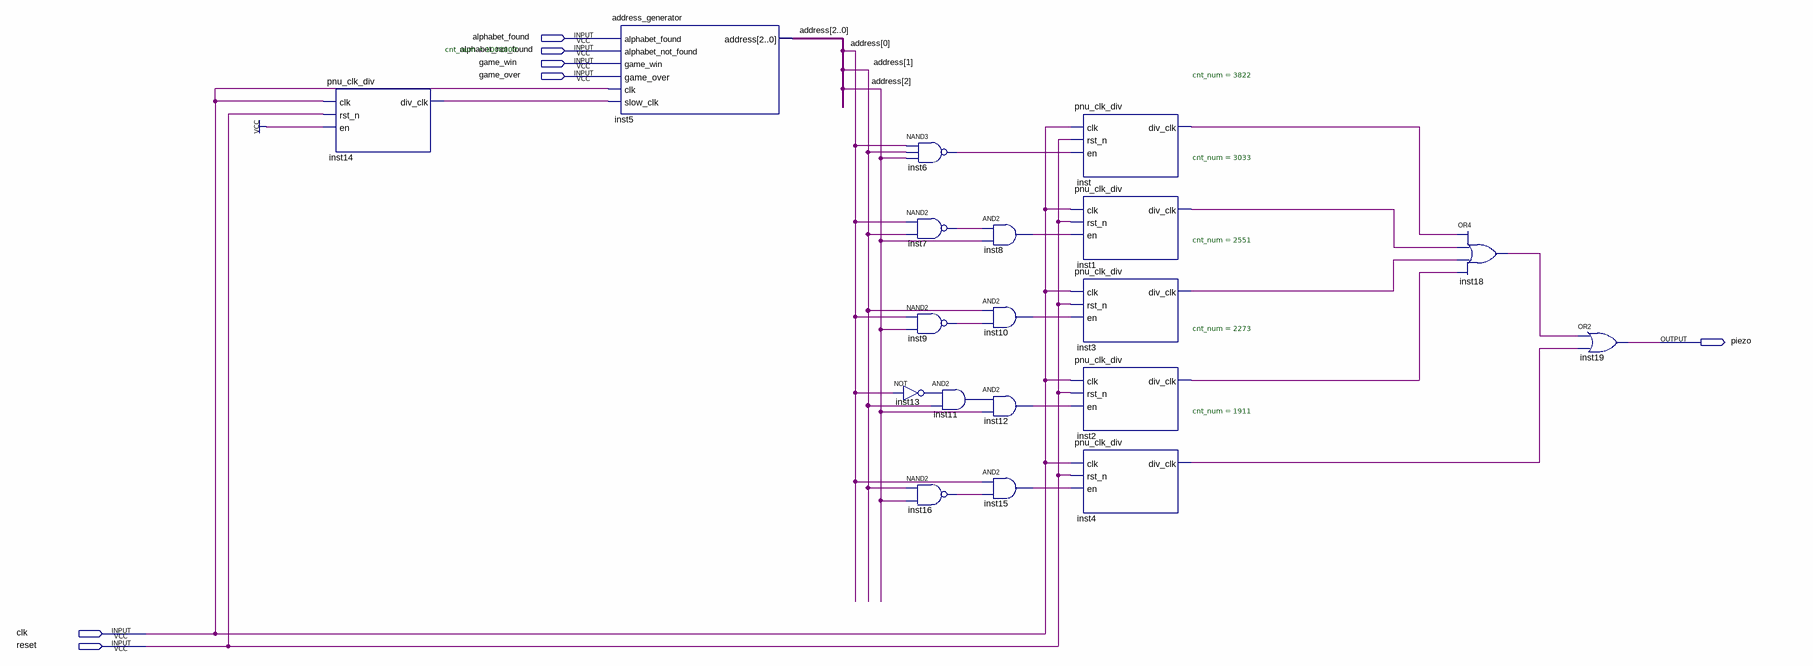
[diagram p0: schematic sheet]
// Quartus schematic sound_controller.bdf as structural Verilog: 19 symbols, 7 pins
module sound_controller (
  input  alphabet_found,
  input  alphabet_not_found,
  input  game_win,
  input  game_over,
  input  clk,
  input  reset,
  output piezo
);

  wire inst1_div_clk, inst2_div_clk, inst3_div_clk, inst4_div_clk, inst6_out, inst7_out, inst8_out,
       inst9_out, inst10_out, inst11_out, inst12_out, inst13_out, inst14_div_clk, inst15_out, inst16_out,
       inst18_out, inst_div_clk;
  wire [2:0] address;

  pnu_clk_div #(.cnt_num(1000000)) inst14 (.clk(clk), .rst_n(reset), .en(1'b1), .div_clk(inst14_div_clk));
  address_generator inst5 (
    .alphabet_found(alphabet_found), .alphabet_not_found(alphabet_not_found), .game_win(game_win),
    .game_over(game_over), .clk(clk), .slow_clk(inst14_div_clk), .address(address));
  not inst13 (inst13_out, address[0]);
  nand inst6 (inst6_out, address[0], address[1], address[2]);
  nand inst7 (inst7_out, address[0], address[1]);
  nand inst9 (inst9_out, address[0], address[2]);
  and inst11 (inst11_out, inst13_out, address[1]);
  nand inst16 (inst16_out, address[1], address[2]);
  and inst8 (inst8_out, inst7_out, address[2]);
  and inst10 (inst10_out, address[1], inst9_out);
  and inst12 (inst12_out, inst11_out, address[2]);
  and inst15 (inst15_out, address[0], inst16_out);
  pnu_clk_div #(.cnt_num(3822)) inst (.clk(clk), .rst_n(reset), .en(inst6_out), .div_clk(inst_div_clk));
  pnu_clk_div #(.cnt_num(3033)) inst1 (.clk(clk), .rst_n(reset), .en(inst8_out), .div_clk(inst1_div_clk));
  pnu_clk_div #(.cnt_num(2551)) inst3 (.clk(clk), .rst_n(reset), .en(inst10_out), .div_clk(inst3_div_clk));
  pnu_clk_div #(.cnt_num(2273)) inst2 (.clk(clk), .rst_n(reset), .en(inst12_out), .div_clk(inst2_div_clk));
  pnu_clk_div #(.cnt_num(1911)) inst4 (.clk(clk), .rst_n(reset), .en(inst15_out), .div_clk(inst4_div_clk));
  or inst18 (inst18_out, inst_div_clk, inst1_div_clk, inst3_div_clk, inst2_div_clk);
  or inst19 (piezo, inst18_out, inst4_div_clk);
endmodule
